# Altium schematic sheet ST_LINKv2.SchDoc
size A4; DrawnBy: Pavel Nadein; DocumentName: ST_LinkV2
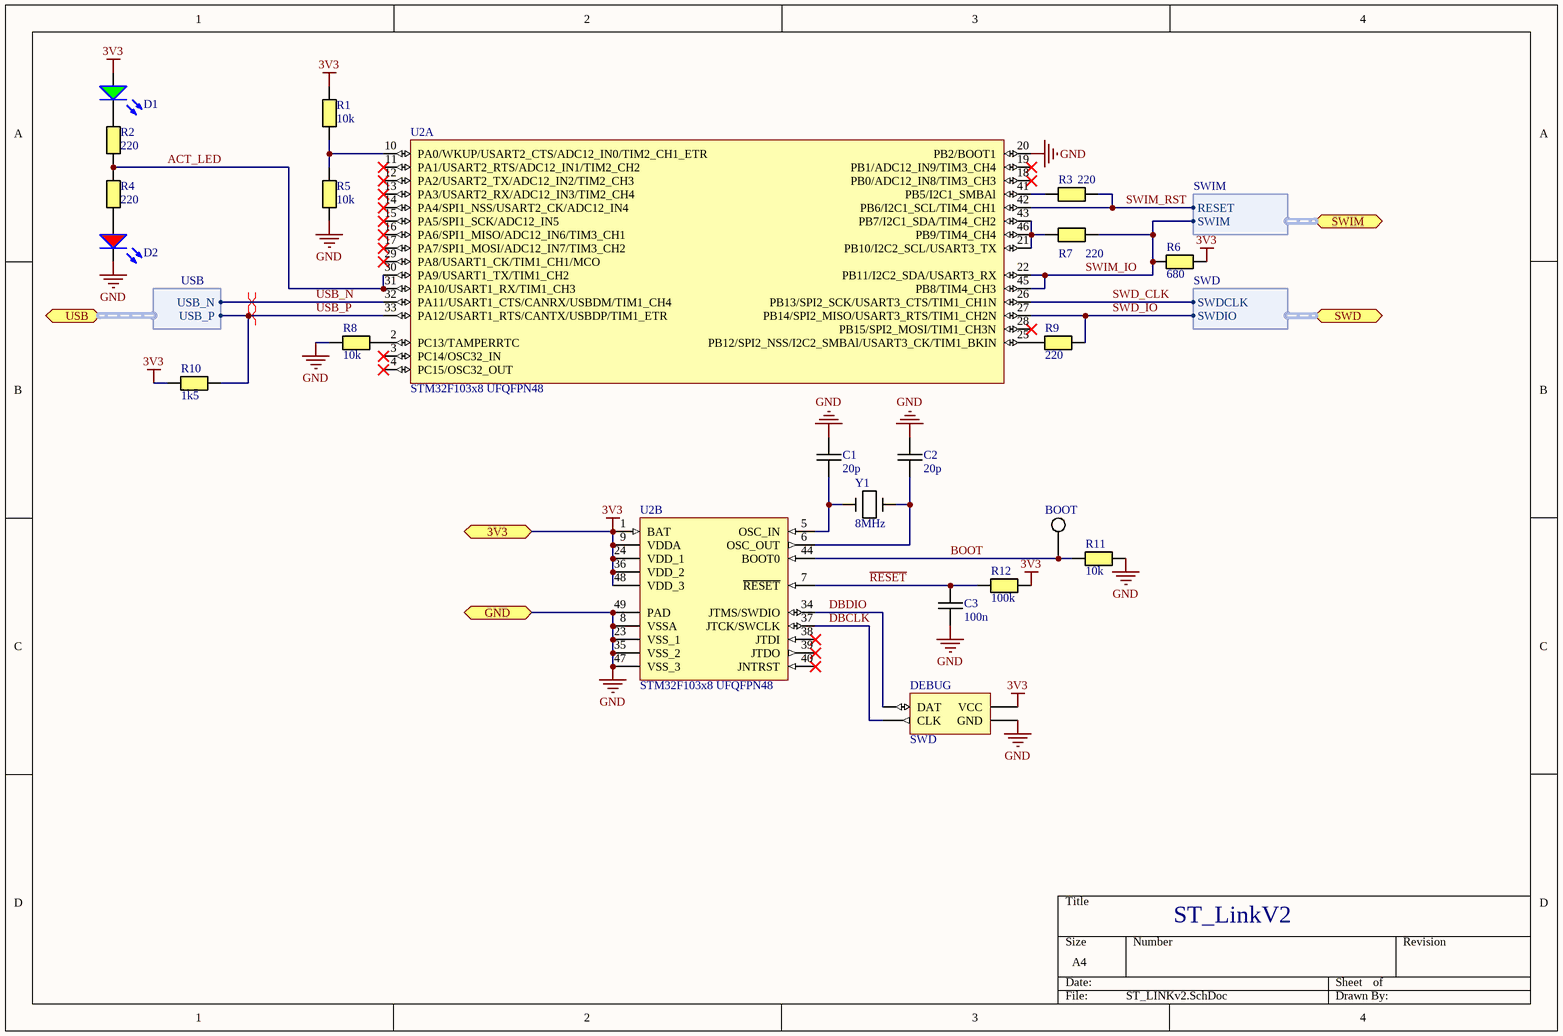
[diagram p0: ST_LINKv2.SchDoc]

## Parts
BOOT  TEST POINT  [TEST POING SMD]  (value not drawn)
C1  20p  [CAPC0603(1608)55_N]
C2  20p  [CAPC0603(1608)55_N]
C3  100n  [CAPC0603(1608)55_N]
D1  1206 LED GREEN  [1206 LED GREEN]  (value not drawn)
D2  1206 LED RED  [1206 LED RED]  (value not drawn)
DEBUG  SWD  [PIN HEADER SINGLE 4]
R1  10k  [RESC0603(1608)_N]
R2  220  [RESC0603(1608)_N]
R3  220  [RESC0603(1608)_N]
R4  220  [RESC0603(1608)_N]
R5  10k  [RESC0603(1608)_N]
R6  680  [RESC0603(1608)_N]
R7  220  [RESC0603(1608)_N]
R8  10k  [RESC0603(1608)_N]
R9  220  [RESC0603(1608)_N]
R10  1k5  [RESC0603(1608)_N]
R11  10k  [RESC0603(1608)_N]
R12  100k  [RESC0603(1608)_N]
U2  STM32F103x8 UFQFPN48  [UFQFPN48 7 x 7 mm, 0.5 mm pitch]  (parts A,B of 2)
Y1  8MHz  [HC49 Crystal]

## Ports
3V3, GND, SWD (harness SWD), SWIM (harness SWIM), USB (harness USB)

## Harnesses
USB: USB_N, USB_P
SWD: SWDIO, SWDCLK
SWIM: SWIM, RESET

## Nets
3V3: D1.A DEBUG.1(VCC) R1.1 R6.2 R10.1 R12.2 U2.1(BAT) U2.9(VDDA) U2.24(VDD_1) U2.36(VDD_2) U2.48(VDD_3) ; port 3V3
GND: C1.1 C2.1 C3.1 D2.K DEBUG.3(GND) R5.2 R8.1 R11.2 U2.8(VSSA) U2.20(PB2/BOOT1) U2.23(VSS_1) U2.35(VSS_2) U2.47(VSS_3) U2.49(PAD) Y1.2 Y1.4 ; port GND
ACT_LED: R2.1 R4.2 U2.30(PA9/USART1_TX/TIM1_CH2) U2.31(PA10/USART1_RX/TIM1_CH3)
BOOT: BOOT.0(TP) R11.1 U2.44(BOOT0)
DBCLK: DEBUG.2(CLK) U2.37(JTCK/SWCLK)
DBDIO: DEBUG.4(DAT) U2.34(JTMS/SWDIO)
~{RESET}: C3.2 R12.1 U2.7(~{RESET})
SWD_CLK: U2.26(PB13/SPI2_SCK/USART3_CTS/TIM1_CH1N) ; port SWD.SWDCLK
SWD_IO: R9.2 U2.27(PB14/SPI2_MISO/USART3_RTS/TIM1_CH2N) ; port SWD.SWDIO
SWIM_IO: R6.1 R7.2 U2.22(PB11/I2C2_SDA/USART3_RX) U2.45(PB8/TIM4_CH3) ; port SWIM.SWIM
SWIM_RST: R3.2 U2.42(PB6/I2C1_SCL/TIM4_CH1) ; port SWIM.RESET
USB_N: U2.32(PA11/USART1_CTS/CANRX/USBDM/TIM1_CH4) ; port USB.USB_N
USB_P: R10.2 U2.33(PA12/USART1_RTS/CANTX/USBDP/TIM1_ETR)
NetC1_2: C1.2 U2.5(OSC_IN) Y1.1
NetC2_2: C2.2 U2.6(OSC_OUT) Y1.3
NetD1_K: D1.K R2.2
NetD2_A: D2.A R4.1
NetR1_2: R1.2 R5.1 U2.10(PA0/WKUP/USART2_CTS/ADC12_IN0/TIM2_CH1_ETR)
NetR3_1: R3.1 U2.41(PB5/I2C1_SMBAl)
NetR7_1: R7.1 U2.21(PB10/I2C2_SCL/USART3_TX) U2.43(PB7/I2C1_SDA/TIM4_CH2) U2.46(PB9/TIM4_CH4)
NetR8_2: R8.2 U2.2(PC13/TAMPERRTC)
NetR9_1: R9.1 U2.25(PB12/SPI2_NSS/I2C2_SMBAl/USART3_CK/TIM1_BKIN)

Not connected (* = marked no-connect by the designer): U2 3(PC14/OSC32_IN)* 4(PC15/OSC32_OUT)* 11(PA1/USART2_RTS/ADC12_IN1/TIM2_CH2)* 12(PA2/USART2_TX/ADC12_IN2/TIM2_CH3)* 13(PA3/USART2_RX/ADC12_IN3/TIM2_CH4)* 14(PA4/SPI1_NSS/USART2_CK/ADC12_IN4)* 15(PA5/SPI1_SCK/ADC12_IN5)* 16(PA6/SPI1_MISO/ADC12_IN6/TIM3_CH1)* 17(PA7/SPI1_MOSI/ADC12_IN7/TIM3_CH2)* 18(PB0/ADC12_IN8/TIM3_CH3)* 19(PB1/ADC12_IN9/TIM3_CH4)* 28(PB15/SPI2_MOSI/TIM1_CH3N)* 29(PA8/USART1_CK/TIM1_CH1/MCO)* 38(JTDI)* 39(JTDO)* 40(JNTRST)*

## Layout directives
differential pair: USB_N, USB_P

## Library data of the parts
C1-C3 = Capacitor M: Ceramic capacitor Medium density
  C1 C2: Value: 20p
  C3: Value: 100n
DEBUG = SWD DEBUG: SWD ST DEBUG
R1-R12 = Resistor M: Resistor Medium Density
  R1 R5 R8 R11: Value: 10k
  R2-R4 R7 R9: Value: 220
  R6: Value: 680
  R10: Value: 1k5
  R12: Value: 100k
U2 = STM32F103x8 UFQFPN48: STM32F103x8
Y1 = CRYSTAL: Value: 8MHz